# Altium project FIT_PM12.PrjPcb (part 9 of 13)

## Sheet ADCs.SchDoc: FIT_PM12 board
size 420 x 297 mm; CheckedBy: G.Kasprowicz; Author: INR Moscow; CompanyName: WUT ISE; DrawnBy: M.Podgórski; Organization: WUT ISE; Address1: PW ISE; Address2: Nowowiejska 15/19 00-665 Warsaw; Address3: gkasprow@gmail.com; DocumentNumber: 4; Revision: 2; SheetNumber: 8; SheetTotal: 34; ModifiedBy: -; CheckedDate: -; Title2: ADCs; DivGrp: WUT ISE; Designer: INR RAS; ModifiedDate: -; ProjectName: Sensor Box
Used 12 times, as channels AFE/ADC1, AFE/ADC2, AFE/ADC3, AFE/ADC4, AFE/ADC5, AFE/ADC6, AFE/ADC7, AFE/ADC8, AFE/ADC9, AFE/ADC10, AFE/ADC11, AFE/ADC12. Parts and nets are listed once, with the designators drawn on the sheet.
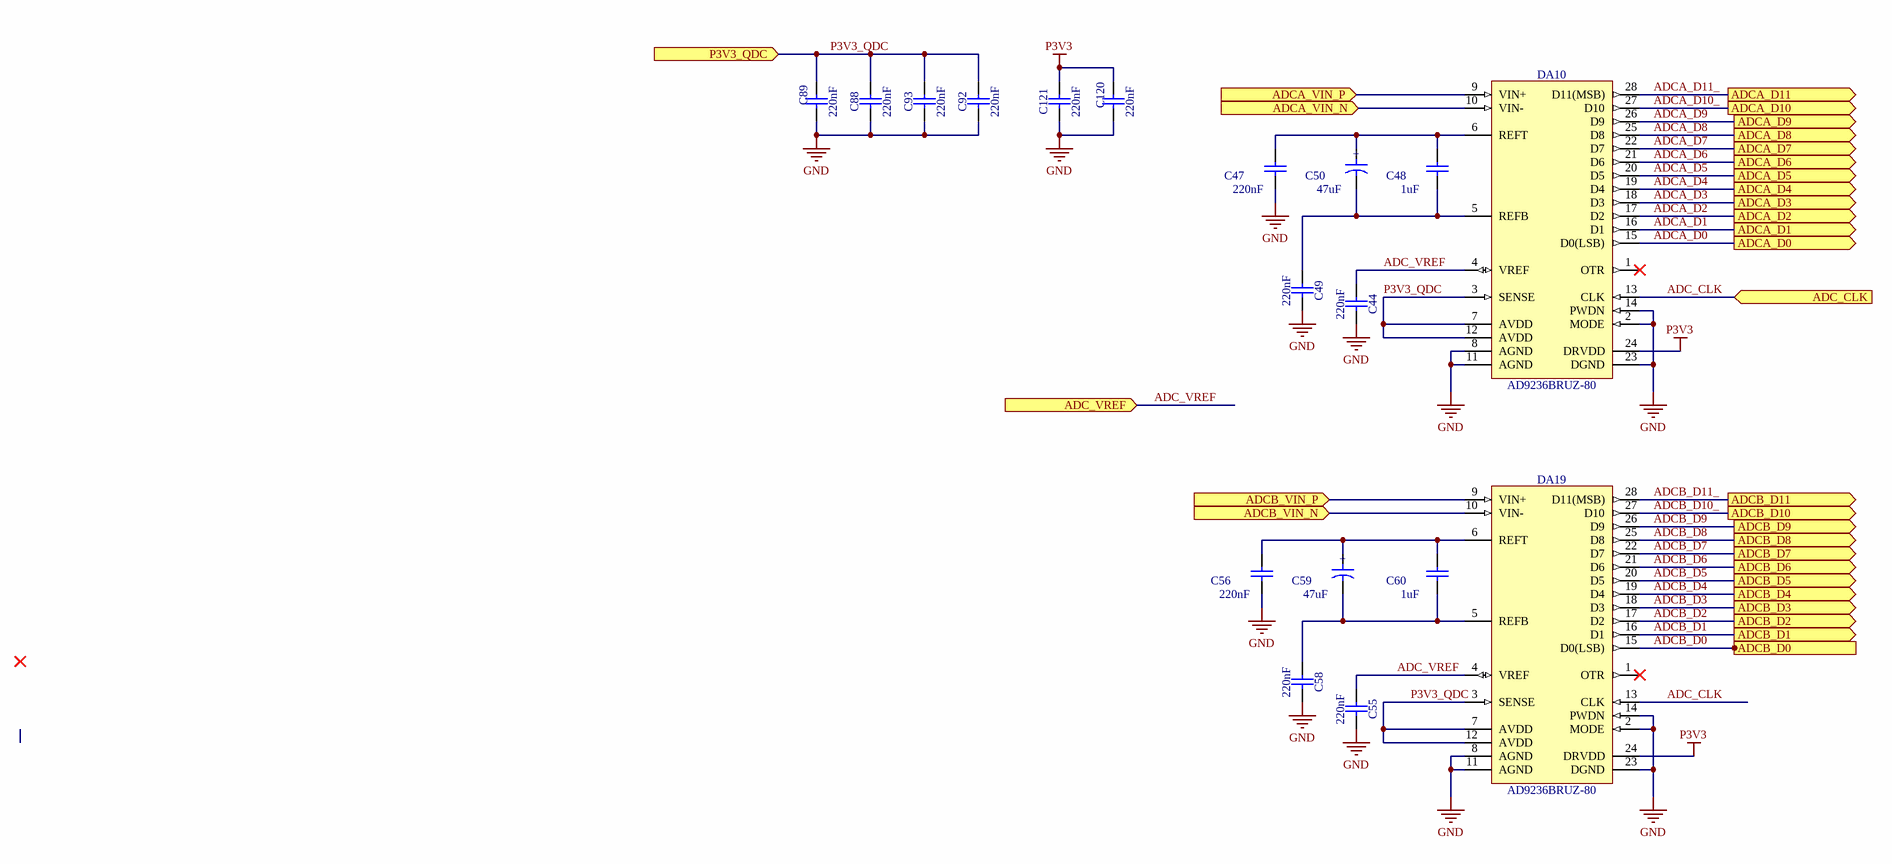
[diagram p29: ADCs.SchDoc]

### Parts
C44  220nF  [CAPC2012X135N]
C47  220nF  [CAPC2012X135N]
C48  1uF  [CAPC2012X140N]
C49  220nF  [CAPC2012X135N]
C50  47uF  [CAPMP3528X120N]
C55  220nF  [CAPC2012X135N]
C56  220nF  [CAPC2012X135N]
C58  220nF  [CAPC2012X135N]
C59  47uF  [CAPMP3528X120N]
C60  1uF  [CAPC2012X140N]
C88  220nF  [CAPC2012X135N]
C89  220nF  [CAPC2012X135N]
C92  220nF  [CAPC2012X135N]
C93  220nF  [CAPC2012X135N]
C120  220nF  [CAPC2012X135N]
C121  220nF  [CAPC2012X135N]
DA10  AD9236BRUZ-80  [SOP65P640X120-28N]
DA19  AD9236BRUZ-80  [SOP65P640X120-28N]

### Ports
ADC_CLK (in), ADC_VREF (in), ADCA_D0 (out), ADCA_D1 (out), ADCA_D2 (out), ADCA_D3 (out), ADCA_D4 (out), ADCA_D5 (out), ADCA_D6 (out), ADCA_D7 (out), ADCA_D8 (out), ADCA_D9 (out), ADCA_D10 (out), ADCA_D11 (out), ADCA_VIN_N (in), ADCA_VIN_P (in), ADCB_D0 (out), ADCB_D1 (out), ADCB_D2 (out), ADCB_D3 (out), ADCB_D4 (out), ADCB_D5 (out), ADCB_D6 (out), ADCB_D7 (out), ADCB_D8 (out), ADCB_D9 (out), ADCB_D10 (out), ADCB_D11 (out), ADCB_VIN_N (in), ADCB_VIN_P (in), P3V3_QDC (in)

### Nets
GND: C44.1 C47.1 C49.1 C55.1 C56.1 C58.1 C88.1 C89.1 C92.1 C93.1 C120.1 C121.1 DA10.2(MODE) DA10.8(AGND) DA10.11(AGND) DA10.14(PWDN) DA10.23(DGND) DA19.2(MODE) DA19.8(AGND) DA19.11(AGND) DA19.14(PWDN) DA19.23(DGND)
P3V3: C120.2 C121.2 DA10.24(DRVDD) DA19.24(DRVDD)
ADC_CLK: DA10.13(CLK) DA19.13(CLK) ; port ADC_CLK
ADC_VREF: C44.2 C55.2 DA10.4(VREF) DA19.4(VREF) ; port ADC_VREF
ADCA_D0: DA10.15(D0(LSB)) ; port ADCA_D0
ADCA_D1: DA10.16(D1) ; port ADCA_D1
ADCA_D2: DA10.17(D2) ; port ADCA_D2
ADCA_D3: DA10.18(D3) ; port ADCA_D3
ADCA_D4: DA10.19(D4) ; port ADCA_D4
ADCA_D5: DA10.20(D5) ; port ADCA_D5
ADCA_D6: DA10.21(D6) ; port ADCA_D6
ADCA_D7: DA10.22(D7) ; port ADCA_D7
ADCA_D8: DA10.25(D8) ; port ADCA_D8
ADCA_D9: DA10.26(D9) ; port ADCA_D9
ADCA_D10_: DA10.27(D10) ; port ADCA_D10
ADCA_D11_: DA10.28(D11(MSB)) ; port ADCA_D11
ADCA_VIN_N: DA10.10(VIN-) ; port ADCA_VIN_N
ADCA_VIN_P: DA10.9(VIN+) ; port ADCA_VIN_P
ADCB_D0: DA19.15(D0(LSB)) ; port ADCB_D0
ADCB_D1: DA19.16(D1) ; port ADCB_D1
ADCB_D2: DA19.17(D2) ; port ADCB_D2
ADCB_D3: DA19.18(D3) ; port ADCB_D3
ADCB_D4: DA19.19(D4) ; port ADCB_D4
ADCB_D5: DA19.20(D5) ; port ADCB_D5
ADCB_D6: DA19.21(D6) ; port ADCB_D6
ADCB_D7: DA19.22(D7) ; port ADCB_D7
ADCB_D8: DA19.25(D8) ; port ADCB_D8
ADCB_D9: DA19.26(D9) ; port ADCB_D9
ADCB_D10_: DA19.27(D10) ; port ADCB_D10
ADCB_D11_: DA19.28(D11(MSB)) ; port ADCB_D11
ADCB_VIN_N: DA19.10(VIN-) ; port ADCB_VIN_N
ADCB_VIN_P: DA19.9(VIN+) ; port ADCB_VIN_P
P3V3_QDC: C88.2 C89.2 C92.2 C93.2 DA10.3(SENSE) DA10.7(AVDD) DA10.12(AVDD) DA19.3(SENSE) DA19.7(AVDD) DA19.12(AVDD) ; port P3V3_QDC
NetC47_2: C47.2 C48.2 C50.1 DA10.6(REFT)
NetC48_1: C48.1 C49.2 C50.2 DA10.5(REFB)
NetC56_2: C56.2 C59.1 C60.2 DA19.6(REFT)
NetC58_2: C58.2 C59.2 C60.1 DA19.5(REFB)

Not connected (* = marked no-connect by the designer): DA10 1(OTR)*; DA19 1(OTR)*

### Channels
AFE/ADC1: designators end in A; ports ADC_CLK=ADC_CLK ADC_VREF=ADC_VREF ADCA_D0=ADCA_D0 ADCA_D1=ADCA_D1 ADCA_D2=ADCA_D2 ADCA_D3=ADCA_D3 ADCA_D4=ADCA_D4 ADCA_D5=ADCA_D5 ADCA_D6=ADCA_D6 ADCA_D7=ADCA_D7 ADCA_D8=ADCA_D8 ADCA_D9=ADCA_D9 ADCA_D10=ADCA_D10_ ADCA_D11=ADCA_D11_ ADCA_VIN_N=ADCA_VIN_N ADCA_VIN_P=ADCA_VIN_P ADCB_D0=ADCB_D0 ADCB_D1=ADCB_D1 ADCB_D2=ADCB_D2 ADCB_D3=ADCB_D3 ADCB_D4=ADCB_D4 ADCB_D5=ADCB_D5 ADCB_D6=ADCB_D6 ADCB_D7=ADCB_D7 ADCB_D8=ADCB_D8 ADCB_D9=ADCB_D9 ADCB_D10=ADCB_D10 ADCB_D11=ADCB_D11 ADCB_VIN_N=ADCB_VIN_N ADCB_VIN_P=ADCB_VIN_P P3V3_QDC=P3V3_QDC
AFE/ADC2: designators end in B; ports ADC_CLK=ADC_CLK ADC_VREF=ADC_VREF ADCA_D0=ADCA_D0 ADCA_D1=ADCA_D1 ADCA_D2=ADCA_D2 ADCA_D3=ADCA_D3 ADCA_D4=ADCA_D4 ADCA_D5=ADCA_D5 ADCA_D6=ADCA_D6 ADCA_D7=ADCA_D7 ADCA_D8=ADCA_D8 ADCA_D9=ADCA_D9 ADCA_D10=ADCA_D10_ ADCA_D11=ADCA_D11_ ADCA_VIN_N=ADCA_VIN_N ADCA_VIN_P=ADCA_VIN_P ADCB_D0=ADCB_D0 ADCB_D1=ADCB_D1 ADCB_D2=ADCB_D2 ADCB_D3=ADCB_D3 ADCB_D4=ADCB_D4 ADCB_D5=ADCB_D5 ADCB_D6=ADCB_D6 ADCB_D7=ADCB_D7 ADCB_D8=ADCB_D8 ADCB_D9=ADCB_D9 ADCB_D10=ADCB_D10 ADCB_D11=ADCB_D11 ADCB_VIN_N=ADCB_VIN_N ADCB_VIN_P=ADCB_VIN_P P3V3_QDC=P3V3_QDC
AFE/ADC3: designators end in C; ports ADC_CLK=ADC_CLK ADC_VREF=ADC_VREF ADCA_D0=ADCA_D0 ADCA_D1=ADCA_D1 ADCA_D2=ADCA_D2 ADCA_D3=ADCA_D3 ADCA_D4=ADCA_D4 ADCA_D5=ADCA_D5 ADCA_D6=ADCA_D6 ADCA_D7=ADCA_D7 ADCA_D8=ADCA_D8 ADCA_D9=ADCA_D9 ADCA_D10=ADCA_D10_ ADCA_D11=ADCA_D11_ ADCA_VIN_N=ADCA_VIN_N ADCA_VIN_P=ADCA_VIN_P ADCB_D0=ADCB_D0 ADCB_D1=ADCB_D1 ADCB_D2=ADCB_D2 ADCB_D3=ADCB_D3 ADCB_D4=ADCB_D4 ADCB_D5=ADCB_D5 ADCB_D6=ADCB_D6 ADCB_D7=ADCB_D7 ADCB_D8=ADCB_D8 ADCB_D9=ADCB_D9 ADCB_D10=ADCB_D10 ADCB_D11=ADCB_D11 ADCB_VIN_N=ADCB_VIN_N ADCB_VIN_P=ADCB_VIN_P P3V3_QDC=P3V3_QDC
AFE/ADC4: designators end in D; ports ADC_CLK=ADC_CLK ADC_VREF=ADC_VREF ADCA_D0=ADCA_D0 ADCA_D1=ADCA_D1 ADCA_D2=ADCA_D2 ADCA_D3=ADCA_D3 ADCA_D4=ADCA_D4 ADCA_D5=ADCA_D5 ADCA_D6=ADCA_D6 ADCA_D7=ADCA_D7 ADCA_D8=ADCA_D8 ADCA_D9=ADCA_D9 ADCA_D10=ADCA_D10_ ADCA_D11=ADCA_D11_ ADCA_VIN_N=ADCA_VIN_N ADCA_VIN_P=ADCA_VIN_P ADCB_D0=ADCB_D0 ADCB_D1=ADCB_D1 ADCB_D2=ADCB_D2 ADCB_D3=ADCB_D3 ADCB_D4=ADCB_D4 ADCB_D5=ADCB_D5 ADCB_D6=ADCB_D6 ADCB_D7=ADCB_D7 ADCB_D8=ADCB_D8 ADCB_D9=ADCB_D9 ADCB_D10=ADCB_D10 ADCB_D11=ADCB_D11 ADCB_VIN_N=ADCB_VIN_N ADCB_VIN_P=ADCB_VIN_P P3V3_QDC=P3V3_QDC
AFE/ADC5: designators end in E; ports ADC_CLK=ADC_CLK ADC_VREF=ADC_VREF ADCA_D0=ADCA_D0 ADCA_D1=ADCA_D1 ADCA_D2=ADCA_D2 ADCA_D3=ADCA_D3 ADCA_D4=ADCA_D4 ADCA_D5=ADCA_D5 ADCA_D6=ADCA_D6 ADCA_D7=ADCA_D7 ADCA_D8=ADCA_D8 ADCA_D9=ADCA_D9 ADCA_D10=ADCA_D10_ ADCA_D11=ADCA_D11_ ADCA_VIN_N=ADCA_VIN_N ADCA_VIN_P=ADCA_VIN_P ADCB_D0=ADCB_D0 ADCB_D1=ADCB_D1 ADCB_D2=ADCB_D2 ADCB_D3=ADCB_D3 ADCB_D4=ADCB_D4 ADCB_D5=ADCB_D5 ADCB_D6=ADCB_D6 ADCB_D7=ADCB_D7 ADCB_D8=ADCB_D8 ADCB_D9=ADCB_D9 ADCB_D10=ADCB_D10 ADCB_D11=ADCB_D11 ADCB_VIN_N=ADCB_VIN_N ADCB_VIN_P=ADCB_VIN_P P3V3_QDC=P3V3_QDC
AFE/ADC6: designators end in F; ports ADC_CLK=ADC_CLK ADC_VREF=ADC_VREF ADCA_D0=ADCA_D0 ADCA_D1=ADCA_D1 ADCA_D2=ADCA_D2 ADCA_D3=ADCA_D3 ADCA_D4=ADCA_D4 ADCA_D5=ADCA_D5 ADCA_D6=ADCA_D6 ADCA_D7=ADCA_D7 ADCA_D8=ADCA_D8 ADCA_D9=ADCA_D9 ADCA_D10=ADCA_D10_ ADCA_D11=ADCA_D11_ ADCA_VIN_N=ADCA_VIN_N ADCA_VIN_P=ADCA_VIN_P ADCB_D0=ADCB_D0 ADCB_D1=ADCB_D1 ADCB_D2=ADCB_D2 ADCB_D3=ADCB_D3 ADCB_D4=ADCB_D4 ADCB_D5=ADCB_D5 ADCB_D6=ADCB_D6 ADCB_D7=ADCB_D7 ADCB_D8=ADCB_D8 ADCB_D9=ADCB_D9 ADCB_D10=ADCB_D10 ADCB_D11=ADCB_D11 ADCB_VIN_N=ADCB_VIN_N ADCB_VIN_P=ADCB_VIN_P P3V3_QDC=P3V3_QDC
AFE/ADC7: designators end in G; ports ADC_CLK=ADC_CLK ADC_VREF=ADC_VREF ADCA_D0=ADCA_D0 ADCA_D1=ADCA_D1 ADCA_D2=ADCA_D2 ADCA_D3=ADCA_D3 ADCA_D4=ADCA_D4 ADCA_D5=ADCA_D5 ADCA_D6=ADCA_D6 ADCA_D7=ADCA_D7 ADCA_D8=ADCA_D8 ADCA_D9=ADCA_D9 ADCA_D10=ADCA_D10_ ADCA_D11=ADCA_D11_ ADCA_VIN_N=ADCA_VIN_N ADCA_VIN_P=ADCA_VIN_P ADCB_D0=ADCB_D0 ADCB_D1=ADCB_D1 ADCB_D2=ADCB_D2 ADCB_D3=ADCB_D3 ADCB_D4=ADCB_D4 ADCB_D5=ADCB_D5 ADCB_D6=ADCB_D6 ADCB_D7=ADCB_D7 ADCB_D8=ADCB_D8 ADCB_D9=ADCB_D9 ADCB_D10=ADCB_D10 ADCB_D11=ADCB_D11 ADCB_VIN_N=ADCB_VIN_N ADCB_VIN_P=ADCB_VIN_P P3V3_QDC=P3V3_QDC
AFE/ADC8: designators end in H; ports ADC_CLK=ADC_CLK ADC_VREF=ADC_VREF ADCA_D0=ADCA_D0 ADCA_D1=ADCA_D1 ADCA_D2=ADCA_D2 ADCA_D3=ADCA_D3 ADCA_D4=ADCA_D4 ADCA_D5=ADCA_D5 ADCA_D6=ADCA_D6 ADCA_D7=ADCA_D7 ADCA_D8=ADCA_D8 ADCA_D9=ADCA_D9 ADCA_D10=ADCA_D10_ ADCA_D11=ADCA_D11_ ADCA_VIN_N=ADCA_VIN_N ADCA_VIN_P=ADCA_VIN_P ADCB_D0=ADCB_D0 ADCB_D1=ADCB_D1 ADCB_D2=ADCB_D2 ADCB_D3=ADCB_D3 ADCB_D4=ADCB_D4 ADCB_D5=ADCB_D5 ADCB_D6=ADCB_D6 ADCB_D7=ADCB_D7 ADCB_D8=ADCB_D8 ADCB_D9=ADCB_D9 ADCB_D10=ADCB_D10 ADCB_D11=ADCB_D11 ADCB_VIN_N=ADCB_VIN_N ADCB_VIN_P=ADCB_VIN_P P3V3_QDC=P3V3_QDC
AFE/ADC9: designators end in I; ports ADC_CLK=ADC_CLK ADC_VREF=ADC_VREF ADCA_D0=ADCA_D0 ADCA_D1=ADCA_D1 ADCA_D2=ADCA_D2 ADCA_D3=ADCA_D3 ADCA_D4=ADCA_D4 ADCA_D5=ADCA_D5 ADCA_D6=ADCA_D6 ADCA_D7=ADCA_D7 ADCA_D8=ADCA_D8 ADCA_D9=ADCA_D9 ADCA_D10=ADCA_D10_ ADCA_D11=ADCA_D11_ ADCA_VIN_N=ADCA_VIN_N ADCA_VIN_P=ADCA_VIN_P ADCB_D0=ADCB_D0 ADCB_D1=ADCB_D1 ADCB_D2=ADCB_D2 ADCB_D3=ADCB_D3 ADCB_D4=ADCB_D4 ADCB_D5=ADCB_D5 ADCB_D6=ADCB_D6 ADCB_D7=ADCB_D7 ADCB_D8=ADCB_D8 ADCB_D9=ADCB_D9 ADCB_D10=ADCB_D10 ADCB_D11=ADCB_D11 ADCB_VIN_N=ADCB_VIN_N ADCB_VIN_P=ADCB_VIN_P P3V3_QDC=P3V3_QDC
AFE/ADC10: designators end in J; ports ADC_CLK=ADC_CLK ADC_VREF=ADC_VREF ADCA_D0=ADCA_D0 ADCA_D1=ADCA_D1 ADCA_D2=ADCA_D2 ADCA_D3=ADCA_D3 ADCA_D4=ADCA_D4 ADCA_D5=ADCA_D5 ADCA_D6=ADCA_D6 ADCA_D7=ADCA_D7 ADCA_D8=ADCA_D8 ADCA_D9=ADCA_D9 ADCA_D10=ADCA_D10_ ADCA_D11=ADCA_D11_ ADCA_VIN_N=ADCA_VIN_N ADCA_VIN_P=ADCA_VIN_P ADCB_D0=ADCB_D0 ADCB_D1=ADCB_D1 ADCB_D2=ADCB_D2 ADCB_D3=ADCB_D3 ADCB_D4=ADCB_D4 ADCB_D5=ADCB_D5 ADCB_D6=ADCB_D6 ADCB_D7=ADCB_D7 ADCB_D8=ADCB_D8 ADCB_D9=ADCB_D9 ADCB_D10=ADCB_D10 ADCB_D11=ADCB_D11 ADCB_VIN_N=ADCB_VIN_N ADCB_VIN_P=ADCB_VIN_P P3V3_QDC=P3V3_QDC
AFE/ADC11: designators end in K; ports ADC_CLK=ADC_CLK ADC_VREF=ADC_VREF ADCA_D0=ADCA_D0 ADCA_D1=ADCA_D1 ADCA_D2=ADCA_D2 ADCA_D3=ADCA_D3 ADCA_D4=ADCA_D4 ADCA_D5=ADCA_D5 ADCA_D6=ADCA_D6 ADCA_D7=ADCA_D7 ADCA_D8=ADCA_D8 ADCA_D9=ADCA_D9 ADCA_D10=ADCA_D10_ ADCA_D11=ADCA_D11_ ADCA_VIN_N=ADCA_VIN_N ADCA_VIN_P=ADCA_VIN_P ADCB_D0=ADCB_D0 ADCB_D1=ADCB_D1 ADCB_D2=ADCB_D2 ADCB_D3=ADCB_D3 ADCB_D4=ADCB_D4 ADCB_D5=ADCB_D5 ADCB_D6=ADCB_D6 ADCB_D7=ADCB_D7 ADCB_D8=ADCB_D8 ADCB_D9=ADCB_D9 ADCB_D10=ADCB_D10 ADCB_D11=ADCB_D11 ADCB_VIN_N=ADCB_VIN_N ADCB_VIN_P=ADCB_VIN_P P3V3_QDC=P3V3_QDC
AFE/ADC12: designators end in L; ports ADC_CLK=ADC_CLK ADC_VREF=ADC_VREF ADCA_D0=ADCA_D0 ADCA_D1=ADCA_D1 ADCA_D2=ADCA_D2 ADCA_D3=ADCA_D3 ADCA_D4=ADCA_D4 ADCA_D5=ADCA_D5 ADCA_D6=ADCA_D6 ADCA_D7=ADCA_D7 ADCA_D8=ADCA_D8 ADCA_D9=ADCA_D9 ADCA_D10=ADCA_D10_ ADCA_D11=ADCA_D11_ ADCA_VIN_N=ADCA_VIN_N ADCA_VIN_P=ADCA_VIN_P ADCB_D0=ADCB_D0 ADCB_D1=ADCB_D1 ADCB_D2=ADCB_D2 ADCB_D3=ADCB_D3 ADCB_D4=ADCB_D4 ADCB_D5=ADCB_D5 ADCB_D6=ADCB_D6 ADCB_D7=ADCB_D7 ADCB_D8=ADCB_D8 ADCB_D9=ADCB_D9 ADCB_D10=ADCB_D10 ADCB_D11=ADCB_D11 ADCB_VIN_N=ADCB_VIN_N ADCB_VIN_P=ADCB_VIN_P P3V3_QDC=P3V3_QDC

### Notes on the sheet
- Project/Equipment
- Document
- Designer
- Drawn by
- Check.by
- Copyright WUT ISE 2024.
  This documentation describes Open Hardware and is licensed under the CERN OHL v.2. You may redistribute and modify this documentation under the terms of the CERN OHL v.2. (http://ohwr.org/CERNOHL). This documentation is distributed WITHOUT ANY EXPRESS OR IMPLIED WARRANTY, INCLUDING OF MERCHANTABILITY, SATISFACTORY QUALITY AND FITNESS FOR A PARTICULAR PURPOSE. Please see the CERN OHL v.2 for applicable conditions.
- Contact
- File
- Last Mod.
- Print Date
- Sheet
- Size
- A3
- of
- Rev
- (in symbol CTE3528-12_47UF_10V_20%_PANASONIC_TPG) +

### Library data of the parts
C44 C47 C49 C55 C56 C58 C88 C89 C92 C93 C120 C121 = CC0805_220NF_50V_10%_X7R: as C215 on sheet JTAG; Part Number: CC0805_220NF_50V_10%_X7R; Component Kind: Standard; Component Type: Standard; Pin Count: 2; Value: 220nF; Status: Preferred; Manufacturer Part Number: CC0805_220NF_50V_10%_X7R; Case: 0805; Mounted: Yes; Socket: No; SMD: Yes; Sense: No; Manufacturer1 Example: MURATA; Manufacturer1 ComponentHeight: 1.35mm; HelpURL: \\cern.ch\dfs\Applications\Altium\Datasheets\CC0805_X7R_MURATA.pdf; Author: CERN DEM JLC; CreateDate: 03.12.2007; LatestRevisionDate: 03.12.2007
C48 C60 = CC0805_1UF_25V_10%_X7R: Non-polarised capacitor; Part Description: SMD Multilayer Chip Ceramic Capacitor; Manufacturer: GENERIC; Manufacturer1 Part Number: C0805C105K3RAC; Voltage: 25V; TC: X7R; Tolerance: ±10%; Part Number: CC0805_1UF_25V_10%_X7R; Component Kind: Standard; Component Type: Standard; Pin Count: 2; Value: 1uF; Status: Preferred; Manufacturer Part Number: CC0805_1UF_25V_10%_X7R; Case: 0805; Mounted: Yes; Socket: No; SMD: Yes; Sense: No; Manufacturer1 Example: KEMET; Manufacturer1 ComponentHeight: 1.4mm; HelpURL: \\cern.ch\dfs\Applications\Altium\Datasheets\CC0805_X7R_KEMET.pdf; Author: CERN DEM JLC; CreateDate: 23.03.2009; LatestRevisionDate: 23.03.2009
C50 C59 = CTE3528-12_47UF_10V_20%_PANASONIC_TPG: Polarised capacitor; Part Description: ESR 0R07 Solid Tantalum Chip Capacitor; Manufacturer Part Number: 10TPG47M; Voltage: 10V; Tolerance: ±20%; Part Number: CTE3528-12_47UF_10V_20%_PANASONIC_TPG; Component Kind: Standard; Component Type: Standard; Pin Count: 2; Value: 47uF; Status: None; Manufacturer: PANASONIC; Case: T; Mounted: Yes; Socket: No; SMD: Yes; Sense: No; ComponentHeight: 1.2mm; HelpURL: \\cern.ch\dfs\Applications\Altium\Datasheets\CTE_PANASONIC_TPG.pdf; Author: CERN DEM JLC; CreateDate: 01.09.2014; LatestRevisionDate: 01.09.2014
DA10 DA19 = AD9236BRUZ-80: 12-Bit, 80 MSPS 3 V ADC; Part Description: 12-Bit, 40 MSPS, 3V Analog-to-Digital Converter; Manufacturer: ANALOG DEVICES; Manufacturer Part Number: AD9235BRUZ-40; PressFit: No; Bonding: No; Part Number: AD9236BRUZ-80; Component Kind: Standard; Component Type: Standard; Device: AD9236BRUZ-80; PackageDescription: SOP, 0.65mm Pitch; 28 Pin, 4.40mm W X 9.70mm L X 1.20mm H body, IPC Medium Density; Pin Count: 28; Case: TSSOP28; Mounted: Yes; Socket: No; SMD: Yes; Sense: No; ComponentHeight: 1.2mm; Author: CERN DEM HF; HelpURL: \\cern.ch\dfs\Applications\Altium\Datasheets\AD9236BRUZ-80.pdf; CreateDate: 06.05.2024; LatestRevisionDate: 06.05.2024